# Altium schematic sheet Ana Şema.SchDoc
size A3; SheetNumber: 1; SheetTotal: 8
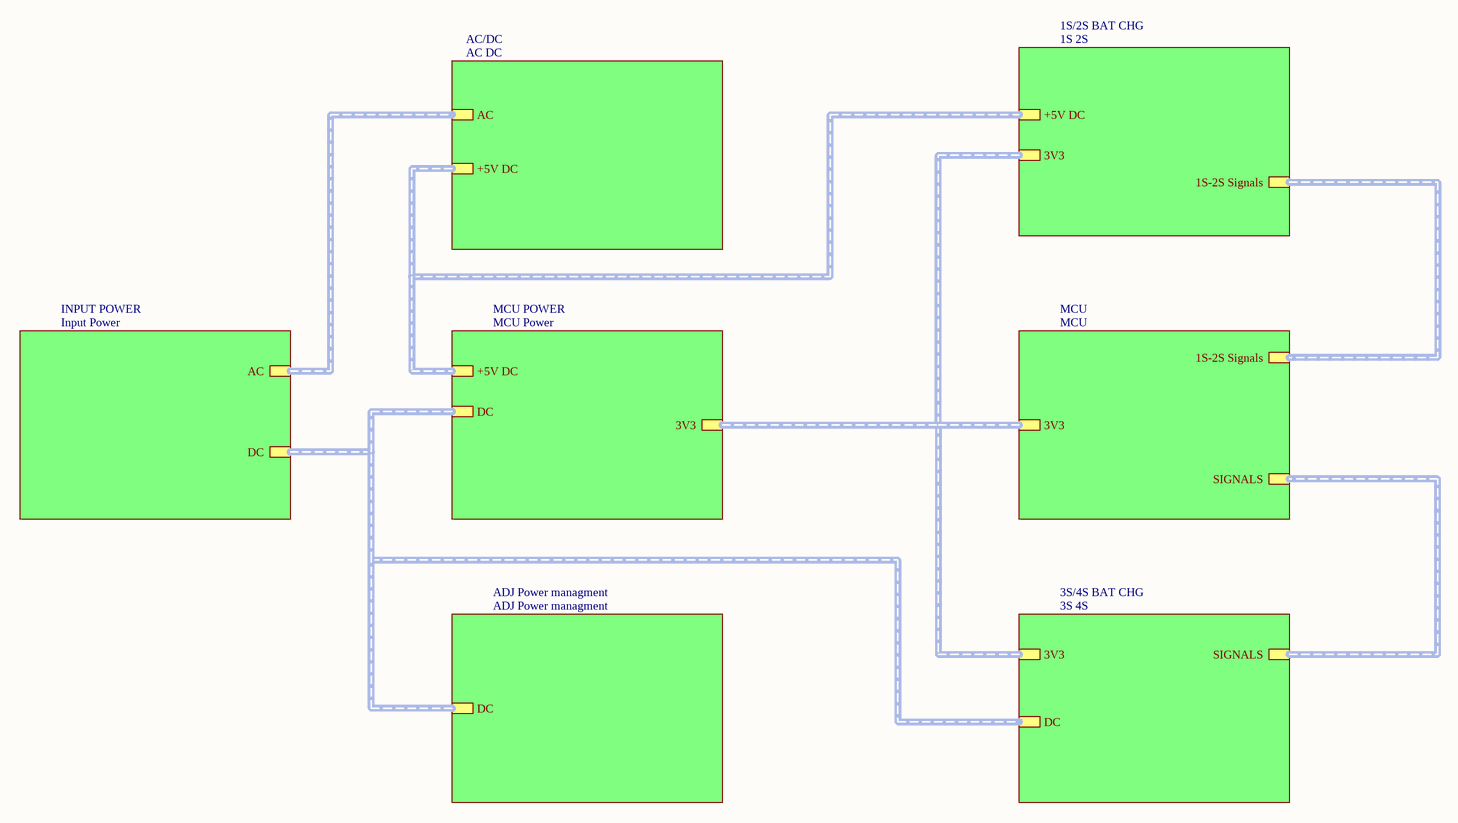
[diagram p0: Ana Şema.SchDoc]

## Sub-sheets
1S/2S BAT CHG = 1S 2S: 1S-2S Signals (harness 1S-2S Signals), 3V3, +5V DC
3S/4S BAT CHG = 3S 4S: SIGNALS (harness SIGNALS), 3V3, DC
AC/DC = AC DC: AC, +5V DC (harness +5V DC)
ADJ Power managment = ADJ Power managment: DC
INPUT POWER = Input Power: DC (harness DC), AC (harness AC)
MCU = MCU: SIGNALS, 1S-2S Signals, 3V3
MCU POWER = MCU Power: DC, 3V3 (harness 3v3 Out), +5V DC

## Buses and harness runs
harness sheet 1S/2S BAT CHG/1S-2S Signals = sheet MCU/1S-2S Signals
harness sheet 1S/2S BAT CHG/3V3 = sheet 3S/4S BAT CHG/3V3 = sheet MCU POWER/3V3 = sheet MCU/3V3
harness sheet 1S/2S BAT CHG/+5V DC = sheet AC/DC/+5V DC = sheet MCU POWER/+5V DC
harness sheet 3S/4S BAT CHG/DC = sheet ADJ Power managment/DC = sheet INPUT POWER/DC = sheet MCU POWER/DC
harness sheet 3S/4S BAT CHG/SIGNALS = sheet MCU/SIGNALS
harness sheet AC/DC/AC = sheet INPUT POWER/AC